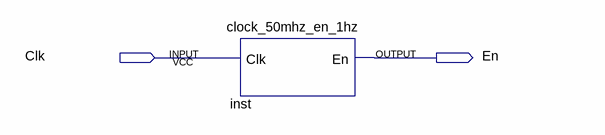
[diagram p0: schematic sheet]
// Quartus schematic Lab4Part3.bdf as structural Verilog: 1 symbols, 2 pins
module Lab4Part3 (
  input  Clk,
  output En
);

  clock_50mhz_en_1hz inst (.Clk(Clk), .En(En));
endmodule
